# Altium schematic sheet FT232RL-REEL1_FT232RL-REEL.schdoc
size 127 x 101 mm
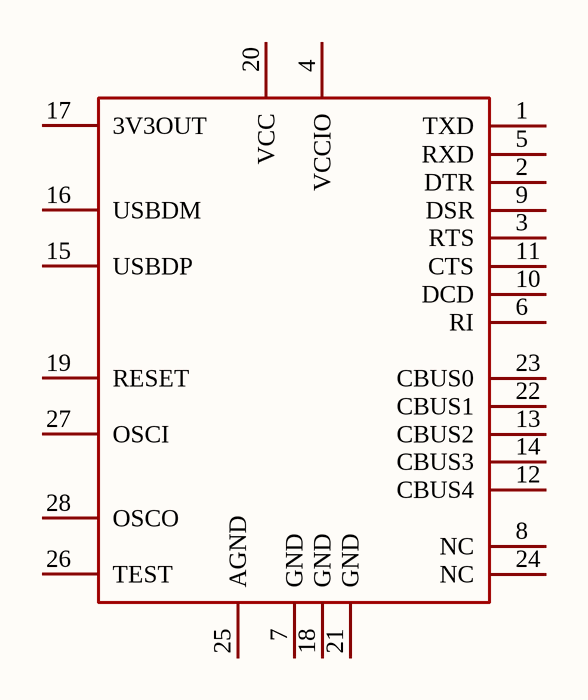
[diagram p0: FT232RL-REEL1_FT232RL-REEL.schdoc]

## Parts
U?  FT232RL-REEL  [SSOP-28_L10.2-W5.3-P0.65-LS7.8-BL]  (value not drawn)

## Nets

Not connected (* = marked no-connect by the designer): U? 1(TXD) 2(DTR) 3(RTS) 4(VCCIO) 5(RXD) 6(RI) 7(GND) 8(NC) 9(DSR) 10(DCD) 11(CTS) 12(CBUS4) 13(CBUS2) 14(CBUS3) 15(USBDP) 16(USBDM) 17(3V3OUT) 18(GND) 19(RESET) 20(VCC) 21(GND) 22(CBUS1) 23(CBUS0) 24(NC) 25(AGND) 26(TEST) 27(OSCI) 28(OSCO)

## Library data of the parts
U? = FT232RL-REEL: Manufacturer: FTDI(飞特帝亚); Add into BOM: yes; Applications Function: USB to UART; Supply Voltage: 3.3V~5.25V; Symbol: FT232RL-REEL; Device: FT232RL-REEL; LCSC Part Name: FT232R USB UART 芯片; Supplier Part: C8690; Manufacturer Part: FT232RL-REEL; Supplier Footprint: SSOP-28-208mil; JLCPCB Part Class: Extended Part; Datasheet: https://atta.szlcsc.com/upload/public/pdf/source/20130221/1457706592200.pdf; Supplier: LCSC; Convert to PCB: yes; Operating Temperature: -40℃~+85℃